# Altium schematic sheet Sheet.SchDoc
size A2; SheetNumber: 1; SheetTotal: 1
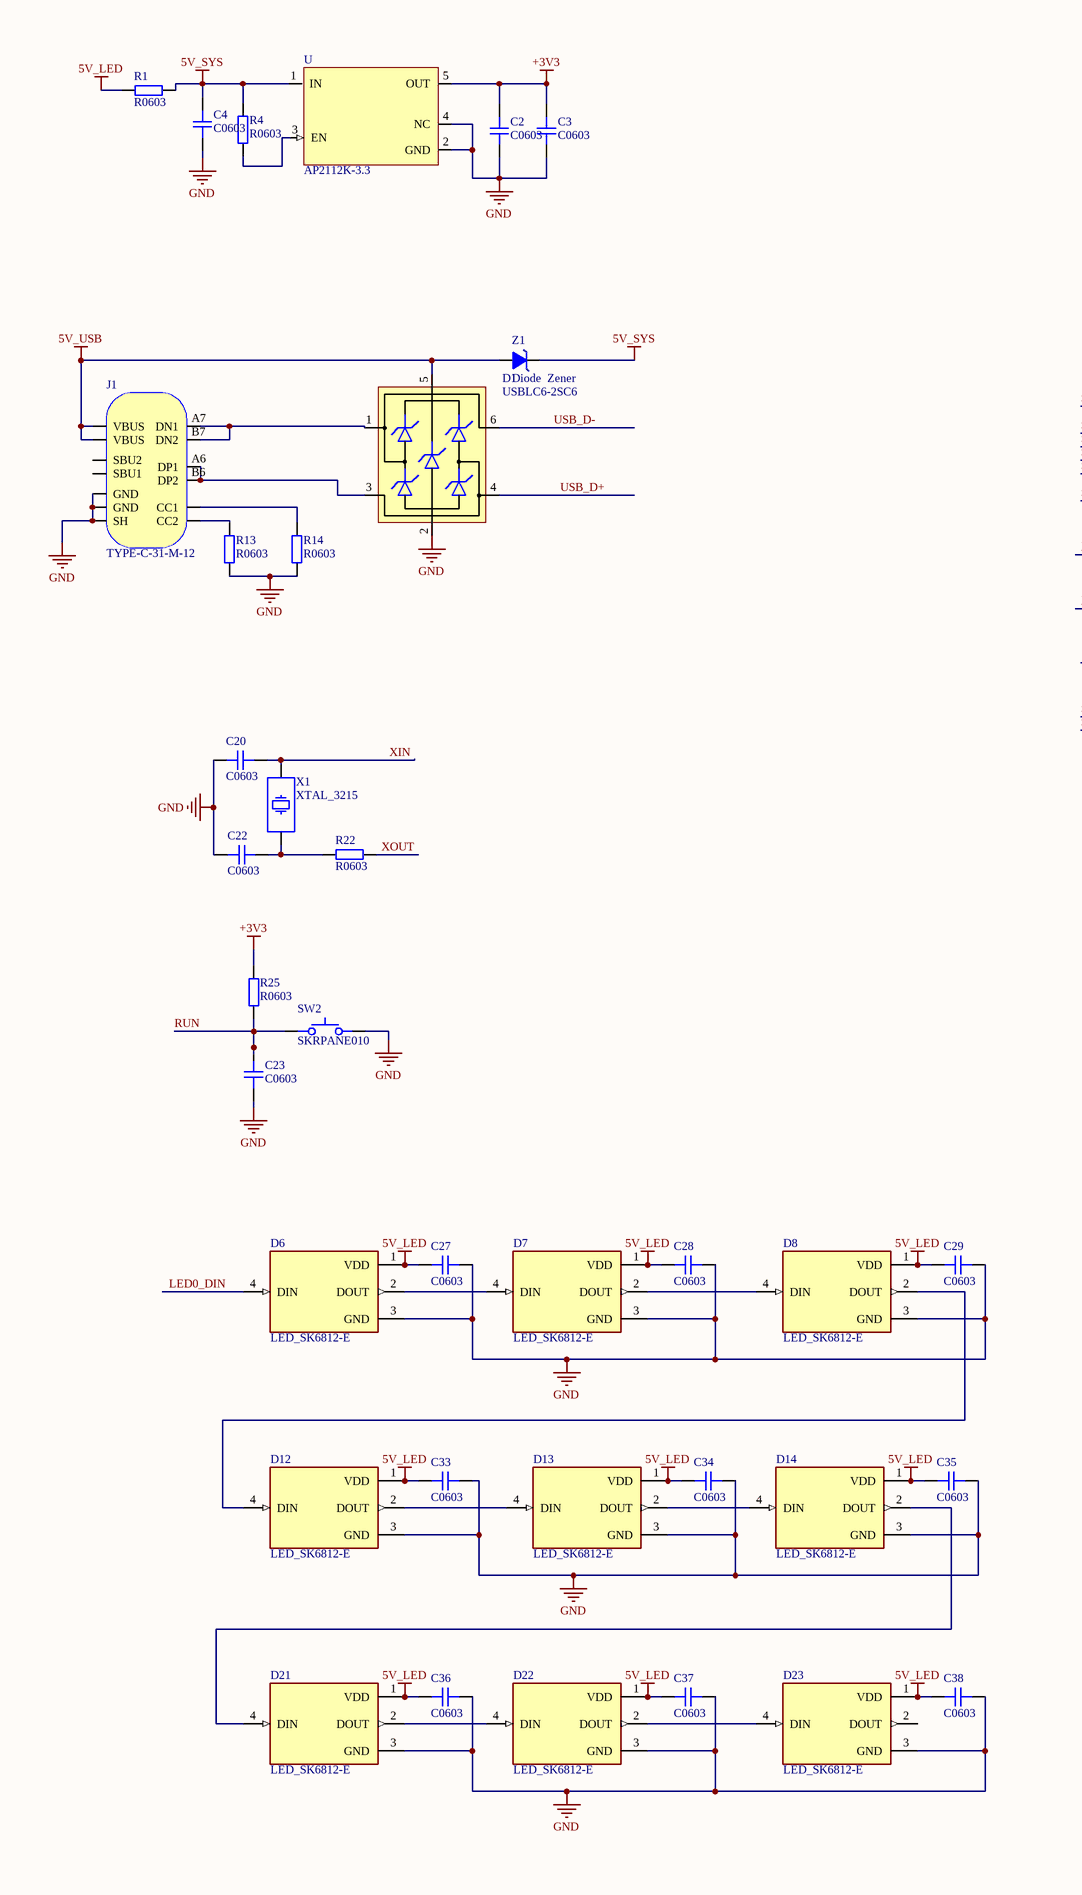
[diagram p0: Sheet.SchDoc, left]
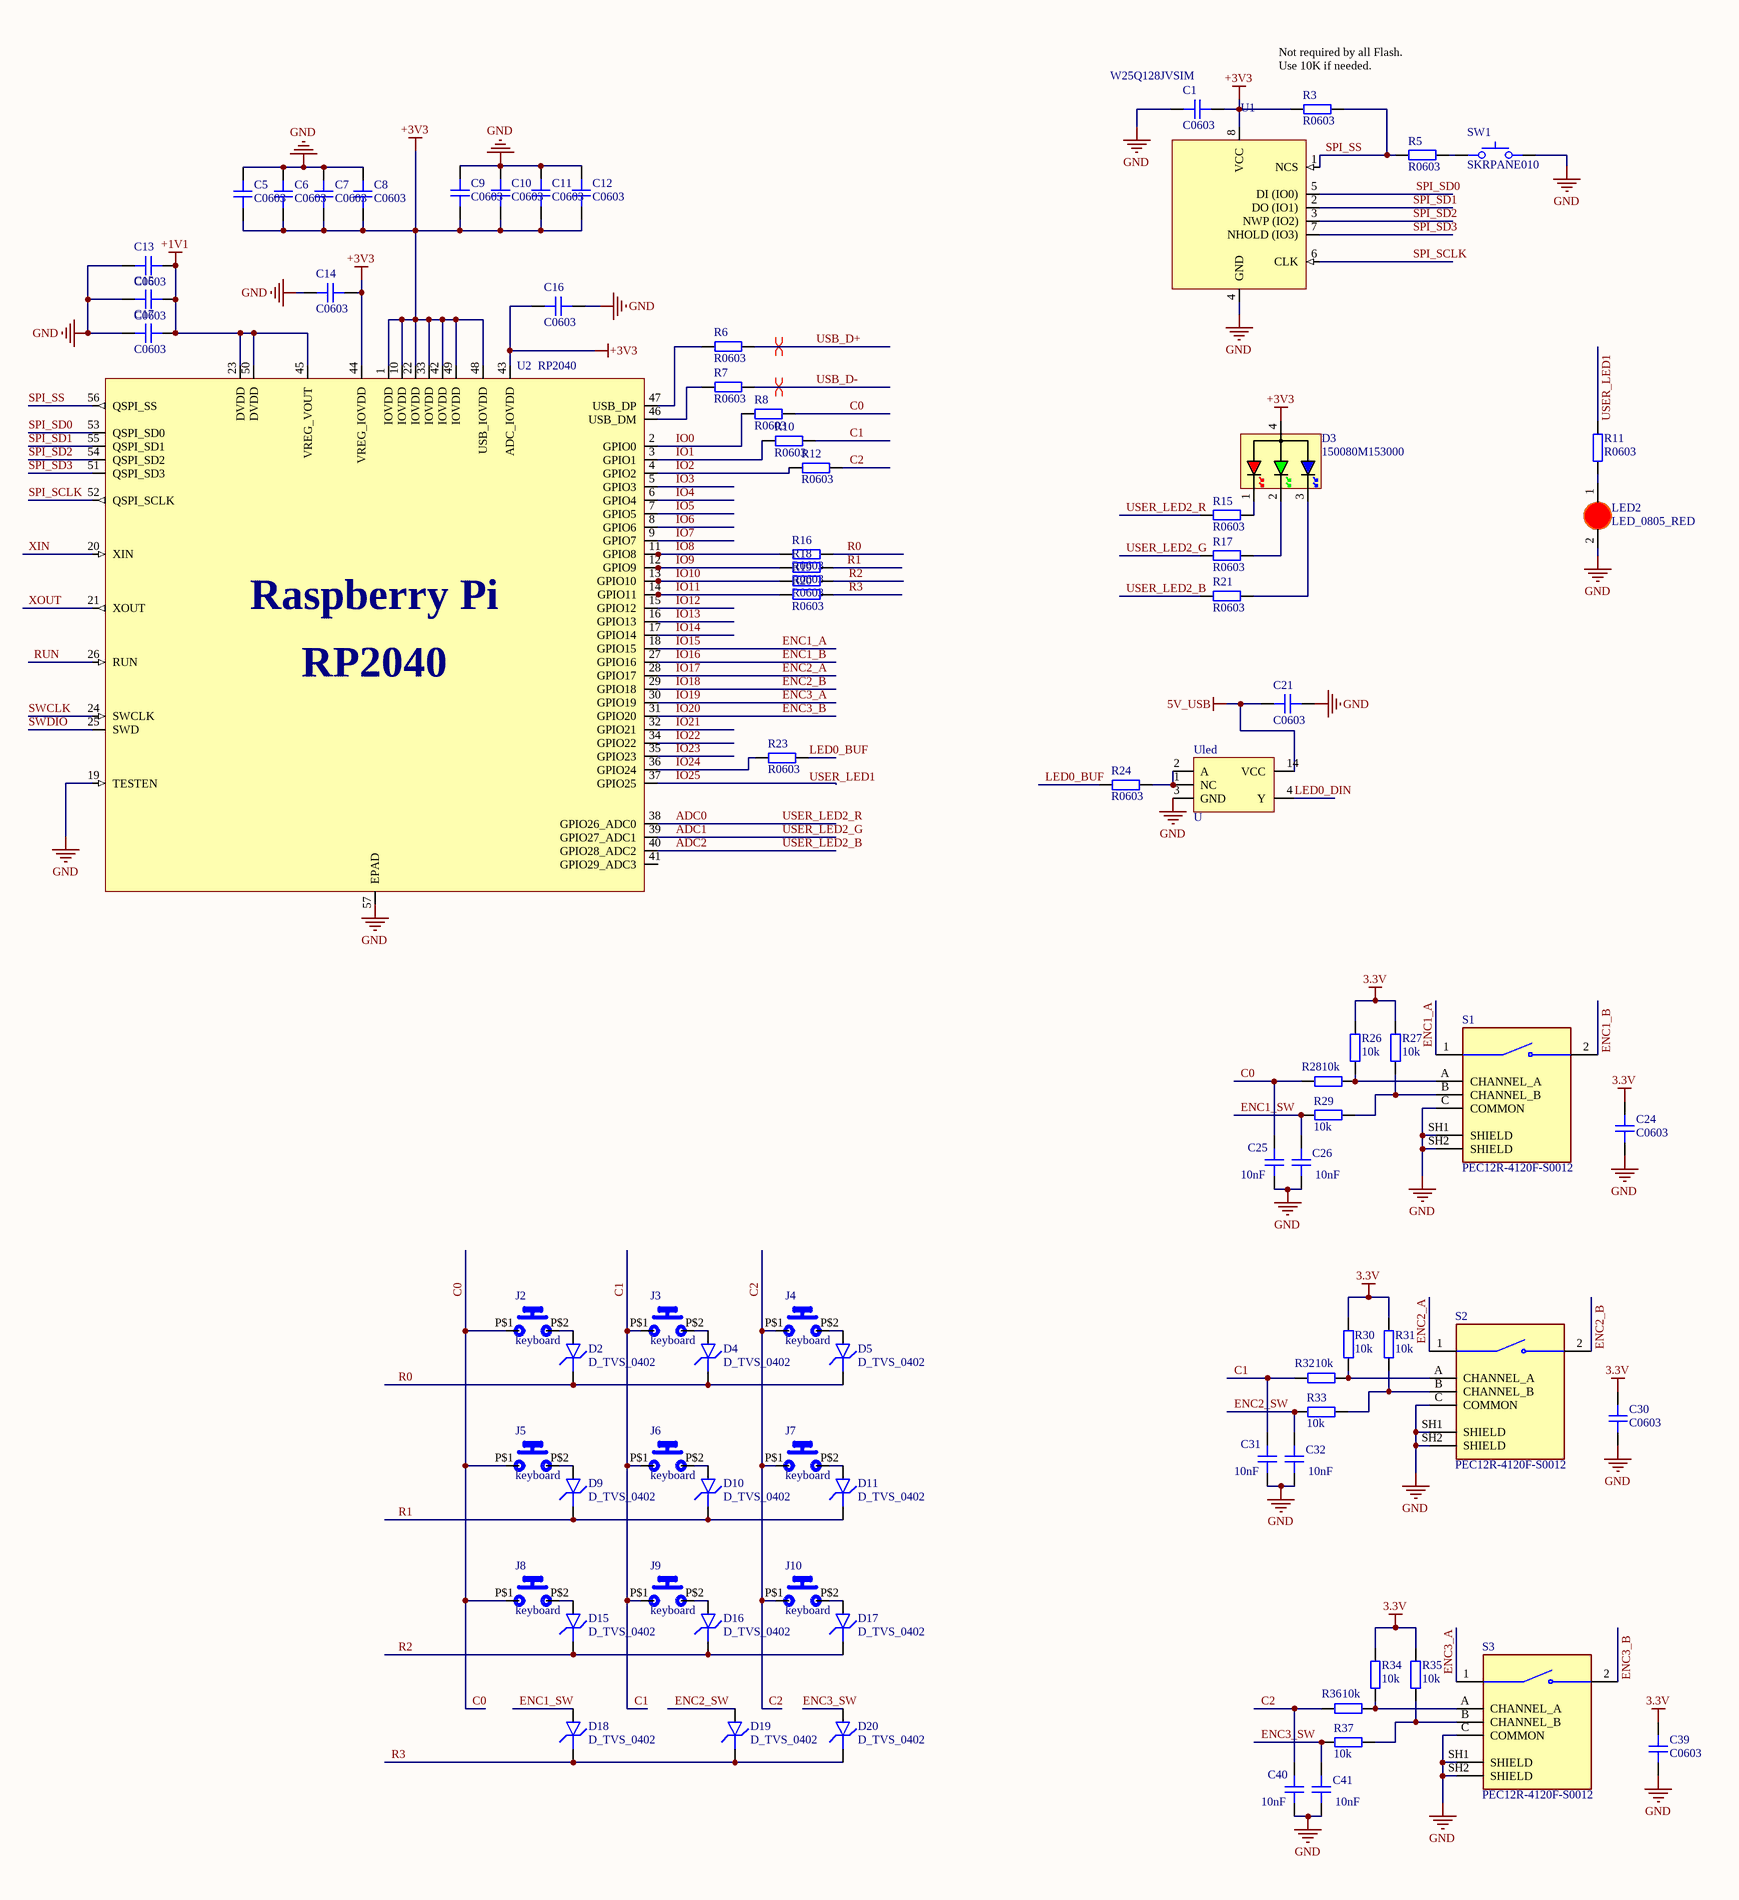
[diagram p1: Sheet.SchDoc, right]

## Parts
C1  C0603  [CAP_0603]
C2  C0603  [CAP_0603]
C3  C0603  [CAP_0603]
C4  C0603  [CAP_0603]
C5  C0603  [CAP_0603]
C6  C0603  [CAP_0603]
C7  C0603  [CAP_0603]
C8  C0603  [CAP_0603]
C9  C0603  [CAP_0603]
C10  C0603  [CAP_0603]
C11  C0603  [CAP_0603]
C12  C0603  [CAP_0603]
C13  C0603  [CAP_0603]
C14  C0603  [CAP_0603]
C15  C0603  [CAP_0603]
C16  C0603  [CAP_0603]
C17  C0603  [CAP_0603]
C20  C0603  [CAP_0603]
C21  C0603  [CAP_0603]
C22  C0603  [CAP_0603]
C23  C0603  [CAP_0603]
C24  C0603  [CAP_0603]
C25  10nF  [CAP_0603]
C26  10nF  [CAP_0603]
C27  C0603  [CAP_0603]
C28  C0603  [CAP_0603]
C29  C0603  [CAP_0603]
C30  C0603  [CAP_0603]
C31  10nF  [CAP_0603]
C32  10nF  [CAP_0603]
C33  C0603  [CAP_0603]
C34  C0603  [CAP_0603]
C35  C0603  [CAP_0603]
C36  C0603  [CAP_0603]
C37  C0603  [CAP_0603]
C38  C0603  [CAP_0603]
C39  C0603  [CAP_0603]
C40  10nF  [CAP_0603]
C41  10nF  [CAP_0603]
D1  USBLC6-2SC6  [SOT-23-6]
D2  D_TVS_0402  [D_0402]
D3  150080M153000  [150080M153000]
D4  D_TVS_0402  [D_0402]
D5  D_TVS_0402  [D_0402]
D6  LED_SK6812-E  [LED_SK6812-E]
D7  LED_SK6812-E  [LED_SK6812-E]
D8  LED_SK6812-E  [LED_SK6812-E]
D9  D_TVS_0402  [D_0402]
D10  D_TVS_0402  [D_0402]
D11  D_TVS_0402  [D_0402]
D12  LED_SK6812-E  [LED_SK6812-E]
D13  LED_SK6812-E  [LED_SK6812-E]
D14  LED_SK6812-E  [LED_SK6812-E]
D15  D_TVS_0402  [D_0402]
D16  D_TVS_0402  [D_0402]
D17  D_TVS_0402  [D_0402]
D18  D_TVS_0402  [D_0402]
D19  D_TVS_0402  [D_0402]
D20  D_TVS_0402  [D_0402]
D21  LED_SK6812-E  [LED_SK6812-E]
D22  LED_SK6812-E  [LED_SK6812-E]
D23  LED_SK6812-E  [LED_SK6812-E]
J1  TYPE-C-31-M-12  [TYPE-C-31-M-12]
J2  keyboard  [SWITCH_keyboard]
J3  keyboard  [SWITCH_keyboard]
J4  keyboard  [SWITCH_keyboard]
J5  keyboard  [SWITCH_keyboard]
J6  keyboard  [SWITCH_keyboard]
J7  keyboard  [SWITCH_keyboard]
J8  keyboard  [SWITCH_keyboard]
J9  keyboard  [SWITCH_keyboard]
J10  keyboard  [SWITCH_keyboard]
LED2  LED_0805_RED  [LED-0805-Red]
R1  R0603  [RES_0603]
R3  R0603  [RES_0603]
R4  R0603  [RES_0603]
R5  R0603  [RES_0603]
R6  R0603  [RES_0603]
R7  R0603  [RES_0603]
R8  R0603  [RES_0603]
R10  R0603  [RES_0603]
R11  R0603  [RES_0603]
R12  R0603  [RES_0603]
R13  R0603  [RES_0603]
R14  R0603  [RES_0603]
R15  R0603  [RES_0603]
R16  R0603  [RES_0603]
R17  R0603  [RES_0603]
R18  R0603  [RES_0603]
R19  R0603  [RES_0603]
R20  R0603  [RES_0603]
R21  R0603  [RES_0603]
R22  R0603  [RES_0603]
R23  R0603  [RES_0603]
R24  R0603  [RES_0603]
R25  R0603  [RES_0603]
R26  10k  [RES_0603]
R27  10k  [RES_0603]
R28  10k  [RES_0603]
R29  10k  [RES_0603]
R30  10k  [RES_0603]
R31  10k  [RES_0603]
R32  10k  [RES_0603]
R33  10k  [RES_0603]
R34  10k  [RES_0603]
R35  10k  [RES_0603]
R36  10k  [RES_0603]
R37  10k  [RES_0603]
S1  PEC12R-4120F-S0012  [XDCR_PEC12R-4120F-S0012]
S2  PEC12R-4120F-S0012  [XDCR_PEC12R-4120F-S0012]
S3  PEC12R-4120F-S0012  [XDCR_PEC12R-4120F-S0012]
SW1  SKRPANE010  [SKRPANE010]
SW2  SKRPANE010  [SKRPANE010]
U  AP2112K-3.3  [SOT23 - 5 Leads]
U1  W25Q128JVSIM  [SOIC-8]
U2  RP2040  [QFN-56-EP]
Uled  U  [SOT23 - 5 Leads]
X1  XTAL_3215  [XTAL_3215-2]
Z1  Diode  Zener  [DIODE SMA]

## Nets
3.3V: C24.2 C30.2 C39.2 R26.2 R27.2 R30.2 R31.2 R34.2 R35.2
5V_LED: C27.2 C28.2 C29.2 C33.1 C34.1 C35.1 C36.2 C37.2 C38.2 D6.1(VDD) D7.1(VDD) D8.1(VDD) D12.1(VDD) D13.1(VDD) D14.1(VDD) D21.1(VDD) D22.1(VDD) D23.1(VDD) R1.2
5V_SYS: C4.2 R1.1 R4.2 U.1(IN) Z1.2(K)
5V_USB: C21.2 D1.5(VBUS) J1.A4B9(VBUS) J1.B4A9(VBUS) Uled.14(VCC) Z1.1(A)
+1V1: C13.1 C15.2 C17.2 U2.23(DVDD) U2.45(VREG_VOUT) U2.50(DVDD)
+3V3: C1.2 C2.2 C3.2 C5.1 C6.1 C7.1 C8.1 C9.1 C10.1 C11.1 C12.1 C14.1 C16.1 D3.4(AC) R3.1 R25.2 U.5(OUT) U1.8(VCC) U2.1(IOVDD) U2.10(IOVDD) U2.22(IOVDD) U2.33(IOVDD) U2.42(IOVDD) U2.43(ADC_IOVDD) U2.44(VREG_IOVDD) U2.48(USB_IOVDD) U2.49(IOVDD)
GND: C1.1 C2.1 C3.1 C4.1 C5.2 C6.2 C7.2 C8.2 C9.2 C10.2 C11.2 C12.2 C13.2 C14.2 C15.1 C16.2 C17.1 C20.1 C21.1 C22.1 C23.1 C24.1 C25.1 C26.1 C27.1 C28.1 C29.1 C30.1 C31.1 C32.1 C33.2 C34.2 C35.2 C36.1 C37.1 C38.1 C39.1 C40.1 C41.1 D1.2(GND) D6.3(GND) D7.3(GND) D8.3(GND) D12.3(GND) D13.3(GND) D14.3(GND) D21.3(GND) D22.3(GND) D23.3(GND) J1.A1B12(GND) J1.B1A12(GND) J1.SH LED2.2(K) R13.1 R14.1 S1.C(COMMON) S1.SH1(SHIELD) S1.SH2(SHIELD) S2.C(COMMON) S2.SH1(SHIELD) S2.SH2(SHIELD) S3.C(COMMON) S3.SH1(SHIELD) S3.SH2(SHIELD) SW1.34 SW2.34 U.2(GND) U.4(NC) U1.4(GND) U2.19(TESTEN) U2.57(EPAD) Uled.3(GND)
ADC0: R15.1 U2.38(GPIO26_ADC0)  [also labelled USER_LED2_R]
ADC1: R17.1 U2.39(GPIO27_ADC1)  [also labelled USER_LED2_G]
ADC2: R21.1 U2.40(GPIO28_ADC2)  [also labelled USER_LED2_B]
C0: C25.2 J2.P$1(P) J5.P$1(P) J8.P$1(P) R8.2 R28.2
C1: C31.2 J3.P$1(P) J6.P$1(P) J9.P$1(P) R10.2 R32.2
C2: C40.2 J4.P$1(P) J7.P$1(P) J10.P$1(P) R12.2 R36.2
ENC1_A: S1.1 U2.18(GPIO15)  [also labelled IO15]
ENC1_B: S1.2 U2.27(GPIO16)  [also labelled IO16]
ENC1_SW: C26.2 D18.A R29.2
ENC2_A: S2.1 U2.28(GPIO17)  [also labelled IO17]
ENC2_B: S2.2 U2.29(GPIO18)  [also labelled IO18]
ENC2_SW: C32.2 D19.A R33.2
ENC3_A: S3.1 U2.30(GPIO19)  [also labelled IO19]
ENC3_B: S3.2 U2.31(GPIO20)  [also labelled IO20]
ENC3_SW: C41.2 D20.A R37.2
IO0: R8.1 U2.2(GPIO0)
IO1: R10.1 U2.3(GPIO1)
IO2: R12.1 U2.4(GPIO2)
IO3: U2.5(GPIO3)
IO4: U2.6(GPIO4)
IO5: U2.7(GPIO5)
IO6: U2.8(GPIO6)
IO7: U2.9(GPIO7)
IO8: R16.1 U2.11(GPIO8)
IO9: R18.1 U2.12(GPIO9)
IO10: R19.1 U2.13(GPIO10)
IO11: R20.1 U2.14(GPIO11)
IO12: U2.15(GPIO12)
IO13: U2.16(GPIO13)
IO14: U2.17(GPIO14)
IO21: U2.32(GPIO21)
IO22: U2.34(GPIO22)
IO23: U2.35(GPIO23)
IO24: R23.1 U2.36(GPIO24)
IO25: U2.37(GPIO25)
LED0_BUF: R23.2 R24.1
LED0_DIN: D6.4(DIN) Uled.4(Y)
R0: D2.K D4.K D5.K R16.2
R1: D9.K D10.K D11.K R18.2
R2: D15.K D16.K D17.K R19.2
R3: D18.K D19.K D20.K R20.2
RUN: C23.2 R25.1 SW2.12 U2.26(RUN)
SPI_SCLK: U1.6(CLK) U2.52(QSPI_SCLK)
SPI_SD0: U1.5(DI_(IO0)) U2.53(QSPI_SD0)
SPI_SD1: U1.2(DO_(IO1)) U2.55(QSPI_SD1)
SPI_SD2: U1.3(NWP_(IO2)) U2.54(QSPI_SD2)
SPI_SD3: U1.7(NHOLD_(IO3)) U2.51(QSPI_SD3)
SPI_SS: R3.2 R5.1 U1.1(NCS) U2.56(QSPI_SS)
SWCLK: U2.24(SWCLK)
SWDIO: U2.25(SWD)
USB_D+: D1.4(IO2) R6.2
USB_D-: D1.6(IO1) R7.2
USER_LED1: R11.1
XIN: C20.2 U2.20(XIN) X1.2
XOUT: R22.2 U2.21(XOUT)
NetC22_2: C22.2 R22.1 X1.1
NetD1_1: D1.1(IO1) J1.A7(DN1) J1.B7(DN2)
NetD1_3: D1.3(IO2) J1.A6(DP1) J1.B6(DP2)
NetD2_A: D2.A J2.P$2(S)
NetD3_1: D3.1(CR) R15.2
NetD3_2: D3.2(CG) R17.2
NetD3_3: D3.3(CB) R21.2
NetD4_A: D4.A J3.P$2(S)
NetD5_A: D5.A J4.P$2(S)
NetD6_2: D6.2(DOUT) D7.4(DIN)
NetD7_2: D7.2(DOUT) D8.4(DIN)
NetD8_2: D8.2(DOUT) D12.4(DIN)
NetD9_A: D9.A J5.P$2(S)
NetD10_A: D10.A J6.P$2(S)
NetD11_A: D11.A J7.P$2(S)
NetD12_2: D12.2(DOUT) D13.4(DIN)
NetD13_2: D13.2(DOUT) D14.4(DIN)
NetD14_2: D14.2(DOUT) D21.4(DIN)
NetD15_A: D15.A J8.P$2(S)
NetD16_A: D16.A J9.P$2(S)
NetD17_A: D17.A J10.P$2(S)
NetD21_2: D21.2(DOUT) D22.4(DIN)
NetD22_2: D22.2(DOUT) D23.4(DIN)
NetJ1_A5: J1.A5(CC1) R14.2
NetJ1_B5: J1.B5(CC2) R13.2
NetLED2_1: LED2.1(A) R11.2
NetR4_1: R4.1 U.3(EN)
NetR5_2: R5.2 SW1.12
NetR6_1: R6.1 U2.47(USB_DP)
NetR7_1: R7.1 U2.46(USB_DM)
NetR24_2: R24.2 Uled.1(NC) Uled.2(A)
NetR26_1: R26.1 R28.1 S1.A(CHANNEL_A)
NetR27_1: R27.1 R29.1 S1.B(CHANNEL_B)
NetR30_1: R30.1 R32.1 S2.A(CHANNEL_A)
NetR31_1: R31.1 R33.1 S2.B(CHANNEL_B)
NetR34_1: R34.1 R36.1 S3.A(CHANNEL_A)
NetR35_1: R35.1 R37.1 S3.B(CHANNEL_B)

Not connected (* = marked no-connect by the designer): D23 2(DOUT); J1 A8(SBU1) B8(SBU2); U2 41(GPIO29_ADC3)

## Layout directives
differential pair: USB_D+, USB_D-

## Notes on the sheet
- (near R3) Not required by all Flash.
  Use 10K if needed.
- Labels drawn without touching a wire or pin: USER_LED1

## Library data of the parts
C1-C17 C20-C41 = CAP_0603: Capacitor SMD 0603; Manufacturer: *; Manufacturer Part Number: *; Distributor Link: *; LCSC: *; Rating: *; Dielectric: *
D1 = USBLC6-2SC6: Low-Capacitance ESD Protection USB; Manufacturer: STMicroelectronics; Manufacturer Part Number: USBLC6-2SC6; Distributor Link: https://www.mouser.de/ProductDetail/STMicroelectronics/USBLC6-2SC6?qs=po45yt2pPpu%2FhNIlwQdTlg%3D%3D
D2 D4 D5 D9-D11 D15-D20 = D_TVS_0402: Diode TVS / ESD 0402
D3 = LED RGB: RGB LED Common Anode SMD Diffused 0805 Top View; Manufacturer: Wurth; Manufacturer Part Number: 150080M153000; Distributor Link: https://www.mouser.de/ProductDetail/Wurth-Elektronik/150080M153000?qs=5aG0NVq1C4wI5cZ2wabu5A%3D%3D
D6-D8 D12-D14 D21-D23 = LED_SK6812-E: SK6812MINI-E is a smart LED control circuit and light emitting circuit in one controlled LED source, which has the shape of a 3528 LED chip.; MF: DONGGUANG OPSCO OPTOELECTRONICS CO., LTD; SnapEDA_Link: https://www.snapeda.com/parts/SK6812-E/DONGGUANG+OPSCO+OPTOELECTRONICS+CO.%252C+LTD/view-part/?ref=snap; Package: Package; Value: *; MP: SK6812-E; Check_prices: https://www.snapeda.com/parts/SK6812-E/DONGGUANG+OPSCO+OPTOELECTRONICS+CO.%252C+LTD/view-part/?ref=eda
J1 = TYPE-C-31-M-12: USB Type C Connector Horizontal SMT; Manufacturer: Koren Hroparts; Manufacturer Part Number: TYPE-C-31-M-12
J2-J10 = keyboard: Switch,Key,SPST-NO,Keyboard,Low Profile,10mA,12VDC,Face Place Mount,Std Force | Cherry Americas MX1A-11NN; SnapEDA_Link: https://www.snapeda.com/parts/MX1A-11NN/Cherry/view-part/?ref=snap; Package: None; Value: *; MF: Cherry; MP: MX1A-11NN; Check_prices: https://www.snapeda.com/parts/MX1A-11NN/Cherry/view-part/?ref=eda
R1 R3-R8 R10-R37 = RES_0603: Resistor SMD 0603; Manufacturer: *; Manufacturer Part Number: *; Distributor Link: *; LCSC: *
S1-S3 = PEC12R-4120F-S0012: Mechanical Encoder Rotary Incremental Flat 0.007N.m Straight Quadrature Digital Square Wave 12PPR Through Hole PC Pin; MF: Bourns Inc.; SnapEDA_Link: https://www.snapeda.com/parts/PEC12R-4120F-S0012/Bourns/view-part/?ref=snap; Package: None; Value: *; MP: PEC12R-4120F-S0012; Check_prices: https://www.snapeda.com/parts/PEC12R-4120F-S0012/Bourns/view-part/?ref=eda
SW1 SW2 = SKRPANE010: Tactile Switch SMD SPST; Manufacturer: Alps Alpine; Manufacturer Part Number: SKRPANE010
U1 = W25Q128JVSIM: 128M-BIT / SERIAL FLASH MEMORY WITH / DUAL/QUAD SPI & QPI & DTR SOIC-8; Manufacturer: Winbond; Manufacturer Part Number: W25Q128JVSIM
U2 = RP2040: 32-Bit Dual-Core ARM Cortex-M0+ Microcontroller; Manufacturer: Raspberry Pi; Manufacturer Part Number: RP2040
Uled = SN74LV1T34DBVR
X1 = XTAL_3215: Crystal SMD 3215; Distributor Link: *
Z1 = Diode Zener